# Altium schematic sheet Power_Distribution.SchDoc
size B; SheetNumber: 1; SheetTotal: 1
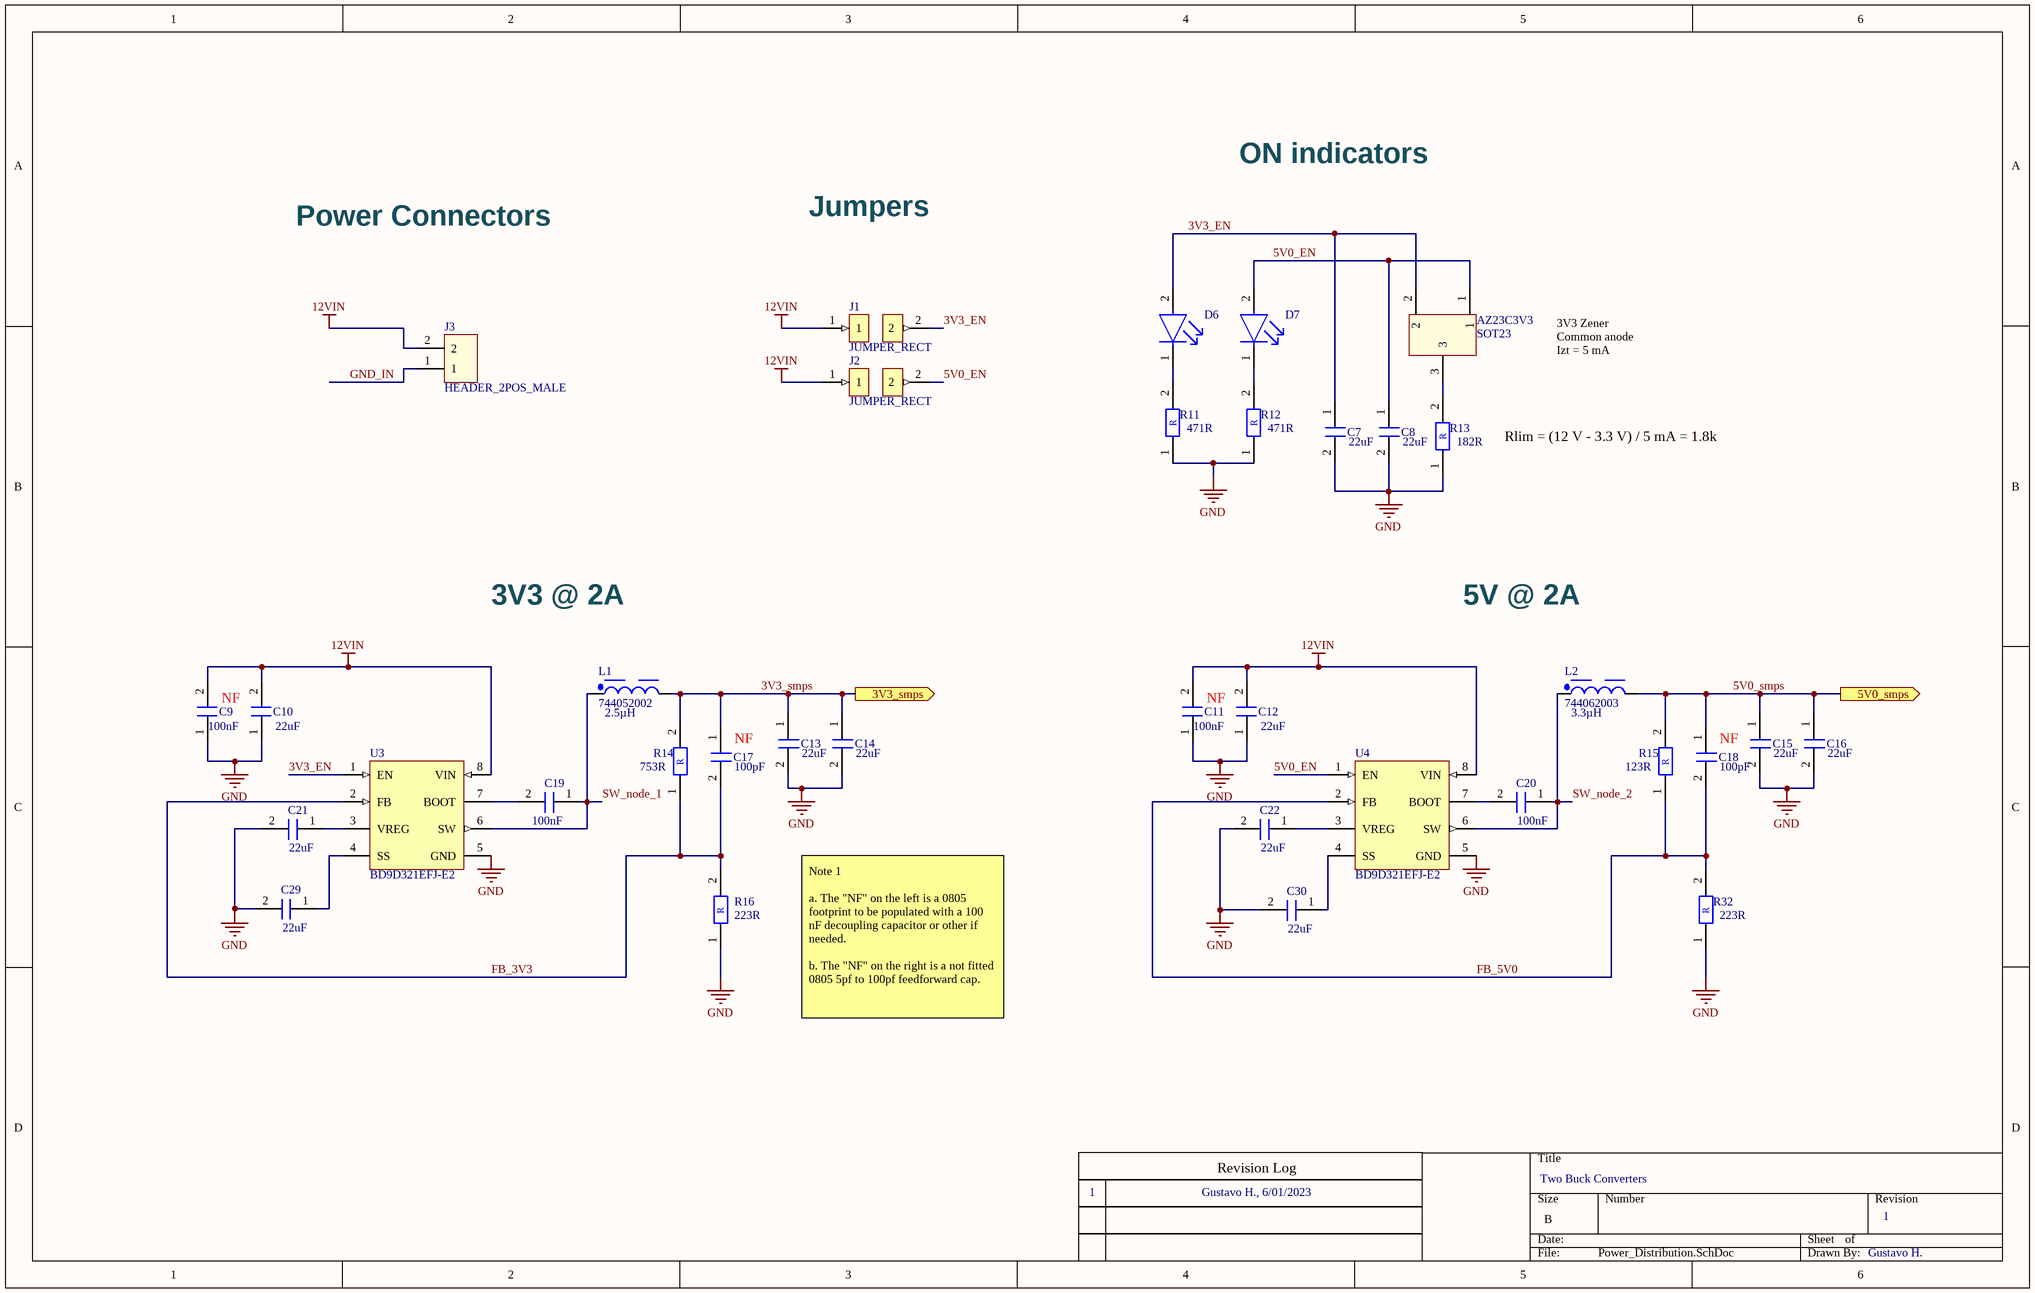
[diagram p0: Power_Distribution.SchDoc]

## Parts
AZ23C3V3  SOT23  [SOT23]
C7  Capacitance: 22uF  [0805_R]  (hidden comment: P.N.)
C8  Capacitance: 22uF  [0805_R]  (hidden comment: P.N.)
C9  Capacitance: 100nF  [0805_R]  (hidden comment: P.N.)
C10  Capacitance: 22uF  [0805_R]  (hidden comment: P.N.)
C11  Capacitance: 100nF  [0805_R]  (hidden comment: P.N.)
C12  Capacitance: 22uF  [0805_R]  (hidden comment: P.N.)
C13  Capacitance: 22uF  [0805_R]  (hidden comment: P.N.)
C14  Capacitance: 22uF  [0805_R]  (hidden comment: P.N.)
C15  Capacitance: 22uF  [0805_R]  (hidden comment: P.N.)
C16  Capacitance: 22uF  [0805_R]  (hidden comment: P.N.)
C17  Capacitance: 100pF  [0805_R]  (hidden comment: P.N.)
C18  Capacitance: 100pF  [0805_R]  (hidden comment: P.N.)
C19  Capacitance: 100nF  [0805_R]  (hidden comment: P.N.)
C20  Capacitance: 100nF  [0805_R]  (hidden comment: P.N.)
C21  Capacitance: 22uF  [0805_R]  (hidden comment: P.N.)
C22  Capacitance: 22uF  [0805_R]  (hidden comment: P.N.)
C29  Capacitance: 22uF  [0805_R]  (hidden comment: P.N.)
C30  Capacitance: 22uF  [0805_R]  (hidden comment: P.N.)
D6  LTST-C191TBKT  [FP-LTST-C191TBKT-MFG]  (value not drawn)
D7  LTST-C191TBKT  [FP-LTST-C191TBKT-MFG]  (value not drawn)
J1  JUMPER_RECT  [JUMPER_RECT]
J2  JUMPER_RECT  [JUMPER_RECT]
J3  HEADER_2POS_MALE  [HEADER_2POS_MALE_VERT_2.54MM]
L1  744052002  Inductance: 2.5µH  [WE-TPC_5818]
L2  744062003  Inductance: 3.3µH  [WE-TPC_6823]
R11  Resistance: 471R  [0805_R]  (hidden comment: P.N.)
R12  Resistance: 471R  [0805_R]  (hidden comment: P.N.)
R13  Resistance: 182R  [0805_R]  (hidden comment: P.N.)
R14  Resistance: 753R  [0805_R]  (hidden comment: P.N.)
R15  Resistance: 123R  [0805_R]  (hidden comment: P.N.)
R16  Resistance: 223R  [0805_R]  (hidden comment: P.N.)
R32  Resistance: 223R  [0805_R]  (hidden comment: P.N.)
U3  BD9D321EFJ-E2  [SOIC127P600X100-8N]
U4  BD9D321EFJ-E2  [SOIC127P600X100-8N]

## Ports
3V3_smps (out), 5V0_smps (out)

## Nets
12VIN: C9.2 C10.2 C11.2 C12.2 J1.1 J2.1 J3.2 U3.8(VIN) U4.8(VIN)
GND: C7.2 C8.2 C9.1 C10.1 C11.1 C12.1 C13.2 C14.2 C15.2 C16.2 C21.2 C22.2 C29.2 C30.2 R11.1 R12.1 R13.1 R16.1 R32.1 U3.5(GND) U4.5(GND)
3V3_EN: AZ23C3V3.2 C7.1 D6.2(A) J1.2 U3.1(EN)
3V3_smps: C13.1 C14.1 C17.1 L1.2 R14.2 ; port 3V3_smps
5V0_EN: AZ23C3V3.1 C8.1 D7.2(A) J2.2 U4.1(EN)
5V0_smps: C15.1 C16.1 C18.1 L2.2 R15.2 ; port 5V0_smps
FB_3V3: C17.2 R14.1 R16.2 U3.2(FB)
FB_5V0: C18.2 R15.1 R32.2 U4.2(FB)
GND_IN: J3.1
SW_node_1: C19.1 L1.1 U3.6(SW)
SW_node_2: C20.1 L2.1 U4.6(SW)
NetAZ23C3V3_3: AZ23C3V3.3 R13.2
NetC19_2: C19.2 U3.7(BOOT)
NetC20_2: C20.2 U4.7(BOOT)
NetC21_1: C21.1 U3.3(VREG)
NetC22_1: C22.1 U4.3(VREG)
NetC29_1: C29.1 U3.4(SS)
NetC30_1: C30.1 U4.4(SS)
NetD6_1: D6.1(C) R11.2
NetD7_1: D7.1(C) R12.2

## Notes on the sheet
- ON indicators
- Power Connectors
- Jumpers
- 3V3 Zener
  Common anode
  Izt = 5 mA
- (near R13) Rlim = (12 V - 3.3 V) / 5 mA = 1.8k
- 3V3 @ 2A
- 5V @ 2A
- (near C9) NF
- (near C11) NF
- (near C17) NF
- (near C18) NF
- Note 1
  a. The "NF" on the left is a 0805 footprint to be populated with a 100 nF decoupling capacitor or other if needed.
  b. The "NF" on the right is a not fitted 0805 5pf to 100pf feedforward cap.
- Two Buck Converters
- 1
- Gustavo H., 6/01/2023
- Gustavo H.
- Revision Log
- (in symbol 0805_R) R

## Library data of the parts
C7-C22 C29 C30 = 0805_C: Generic 0805 Capacitor; Voltage Rating: 10V; Dielectric: XR7
D6 D7 = CMP-22017-000008-1: LED BLUE CLEAR CHIP SMD; Lens Color: Colorless; Dominant Wavelength: 475nm; Forward Current: 20mA; Wavelength: 468nm; Viewing Angle: 130°; Power Dissipation: 76mW; Luminous Intensity: 180mcd; Reverse Voltage: 5V; Number of Elements: 1; Lens Style: Diffused; Forward Voltage: 3.8V; Max Power Dissipation: 75mW; Case Code (Metric): 1608; Packaging: Tape and Reel; Case/Package: 0603; Depth: 1.6mm; Mount: Surface Mount; Lead Free: Lead Free; Min Operating Temperature: -20°C; Lens Transparency: Clear; Illumination Color: Blue; Height: 0.55mm; Test Current: 20mA; Case Code (Imperial): 0603; Max Operating Temperature: 80°C; Number of Pins: 2; Length: 0.8mm; Radiation Hardening: No; Package Quantity: 1; Number of LEDs: 1; Width: 0.8mm; Color: Blue
J1 J2 = JUMPER_RECT: Small rectangular jumper
L1 = CMP-0227-00410-3: NexarPartId: 22866863; Self Resonant Frequency: 85MHz; Inductance Tolerance: 30%; DC Resistance (DCR): 30mΩ; Current Rating: 2.4A; Height: 1.8mm; Ambient Temperature Range Low: -40°C; Min Operating Temperature: -40°C; Packaging: Cut Tape (CT); Number of Pins: 2; Length: 5.8mm; RoHS: Compliant; Max Operating Temperature: 125°C; Ambient Temperature Range High: 95°C; Width: 5.8mm
L2 = CMP-0227-00249-3: NexarPartId: 24533145; Saturation Current: 2.5A; Tolerance: 30%; DC Resistance (DCR): 20mΩ; Current Rating: 2.8A; Core Material: Ferrite; Self Resonant Frequency: 55MHz; Test Frequency: 100kHz; Shielding: Shielded; Mount: Surface Mount; RoHS: Compliant; Ambient Temperature Range High: 95°C; Number of Pins: 2; Case/Package: 2727; Max Operating Temperature: 125°C; Termination: SMD/SMT; Width: 6.8mm; Inductance Tolerance: 30%; Composition: Wirewound; REACH SVHC: Unknown; Ambient Temperature Range Low: -40°C; Case Code (Metric): 6868; Height: 2.3mm; Height - Seated (Max): 2.4892mm; Max DC Current: 2.8A; Lead Free: Lead Free; RMS Current (Irms): 2.8A; Length: 6.8mm; Min Operating Temperature: -40°C; Case Code (Imperial): 2727; Packaging: Tape & Reel (TR)
R11-R16 R32 = 0805_R: Generic 0805 Resistor; Power Rating: 0.5W
U3 U4 = CMP-019-00049-1: ICREGBUCKADJ3ASYNC8HTSOP; Max Output current: 3A; Number of Outputs: 1; Max Output Voltage: 7V; Min Output Voltage: 765mV; Min Supply Voltage: 4.5V; Max Supply Voltage: 18V; Output Configuration: Positive; Output Type: Adjustable; Switching Frequency: 700kHz; Synchronous Rectifier: Yes; Pins: 8; Min Operating Temperature: -40°C; RoHS Compliant: Yes; Mounting Technology: Surface Mount; Package Quantity: 2500; Output Current: 3A; Max Operating Temperature: 85°C; Lead Free: Lead Free; Series: -; Reach SVHC Compliant: Unknown; Packaging: Tape and Reel; Output Voltage: 7V; Operating Supply Voltage: 18V; Min Input Voltage: 4.5V